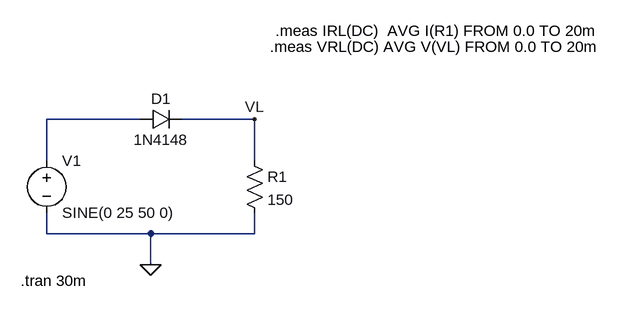
[diagram p0: schematic pozitif_Yarım_dalga_itü.asc]
pozitif_Yarım_dalga_itü.asc, the LTspice schematic file:
Version 4
SHEET 1 1064 680
WIRE 336 32 192 32
WIRE 512 32 400 32
WIRE 192 96 192 32
WIRE 512 96 512 32
WIRE 192 208 192 176
WIRE 352 208 192 208
WIRE 512 208 512 176
WIRE 512 208 352 208
WIRE 352 256 352 208
FLAG 352 256 0
FLAG 512 32 VL
SYMBOL voltage 192 80 R0
WINDOW 123 0 0 Left 0
WINDOW 39 0 0 Left 0
SYMATTR InstName V1
SYMATTR Value SINE(0 25 50 0)
SYMBOL diode 336 48 R270
WINDOW 0 32 32 VTop 2
WINDOW 3 0 32 VBottom 2
SYMATTR InstName D1
SYMATTR Value 1N4148
SYMBOL res 496 80 R0
SYMATTR InstName R1
SYMATTR Value 150
TEXT 152 280 Left 2 !.tran 30m
TEXT 536 -80 Left 2 !.meas VRL(DC) AVG V(VL) FROM 0.0 TO 20m
TEXT 544 -104 Left 2 !.meas IRL(DC)  AVG I(R1) FROM 0.0 TO 20m

The netlist it stands for:
* pozitif_Yarım_dalga_itü.asc
V1 N001 0 SINE(0 25 50 0)
D1 N001 VL 1N4148
R1 VL 0 150
.model D D
.lib standard.dio
.tran 30m
.meas VRL(DC) AVG V(VL) FROM 0.0 TO 20m
.meas IRL(DC)  AVG I(R1) FROM 0.0 TO 20m
.backanno
.end